# EAGLE design bga_test (EAGLE 6.4)
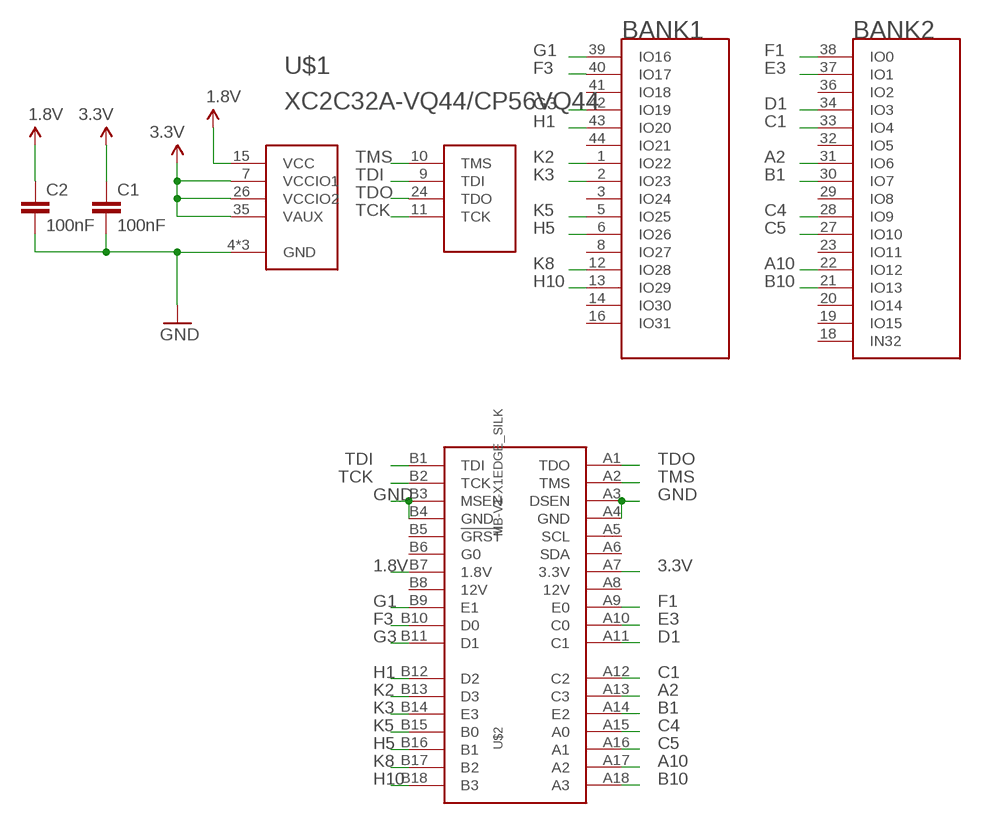
[diagram p0: schematic, sheet 1]

## Parts
C1  100nF  CAP0402-CAP  [0402-CAP]
C2  100nF  CAP0402-CAP  [0402-CAP]
U$1  XC2C32A-VQ44/CP56VQ44  [XILINX_VQ44]
U$2  MB-V1-X1EDGE_SILK  [MB-V1-X1-EDGE]

## Nets
1.8V: C2.1 U$1.15(VCC) U$2.B7(1.8V)
3.3V: C1.1 U$1.7(VCCIO1) U$1.26(VCCIO2) U$1.35(VAUX) U$2.A7(3.3V)
A2: U$1.31(IO6) U$2.A13(C3)
A10: U$1.22(IO12) U$2.A17(A2)
B1: U$1.30(IO7) U$2.A14(E2)
B10: U$1.21(IO13) U$2.A18(A3)
C1: U$1.33(IO4) U$2.A12(C2)
C4: U$1.28(IO9) U$2.A15(A0)
C5: U$1.27(IO10) U$2.A16(A1)
D1: U$1.34(IO3) U$2.A11(C1)
E3: U$1.37(IO1) U$2.A10(C0)
F1: U$1.38(IO0) U$2.A9(E0)
F3: U$1.40(IO17) U$2.B10(D0)
G1: U$1.39(IO16) U$2.B9(E1)
G3: U$1.42(IO19) U$2.B11(D1)
GND: C1.2 C2.2 U$1.4(GND) U$1.17(GND) U$1.25(GND) U$2.A3(DSEN) U$2.A4(GND) U$2.B3(MSEN) U$2.B4(GND)
H1: U$1.43(IO20) U$2.B12(D2)
H5: U$1.6(IO26) U$2.B16(B1)
H10: U$1.13(IO29) U$2.B18(B3)
K2: U$1.1(IO22) U$2.B13(D3)
K3: U$1.2(IO23) U$2.B14(E3)
K5: U$1.5(IO25) U$2.B15(B0)
K8: U$1.12(IO28) U$2.B17(B2)
TCK: U$1.11(TCK) U$2.B2(TCK)
TDI: U$1.9(TDI) U$2.B1(TDI)
TDO: U$1.24(TDO) U$2.A1(TDO)
TMS: U$1.10(TMS) U$2.A2(TMS)
Unconnected: U$1.3(IO24) U$1.8(IO27) U$1.14(IO30) U$1.16(IO31) U$1.18(IN32) U$1.19(IO15) U$1.20(IO14) U$1.23(IO11) U$1.29(IO8) U$1.32(IO5) U$1.36(IO2) U$1.41(IO18) U$1.44(IO21) U$2.A5(SCL) U$2.A6(SDA) U$2.A8(12V) U$2.B5(!GRST) U$2.B6(G0) U$2.B8(12V)

## Library data of the parts
C1 C2 = SparkFun-Capacitors:CAP: Capacitor Standard 0603 ceramic capacitor, and 0.1" leaded capacitor.
U$1 = kmod-xilinx:XC2C32A-VQ44/CP56: XC2C32A, with support for the VQ44 and CP56 footprints
U$2 = kmod-connectors:MB-V1-X1

## Board
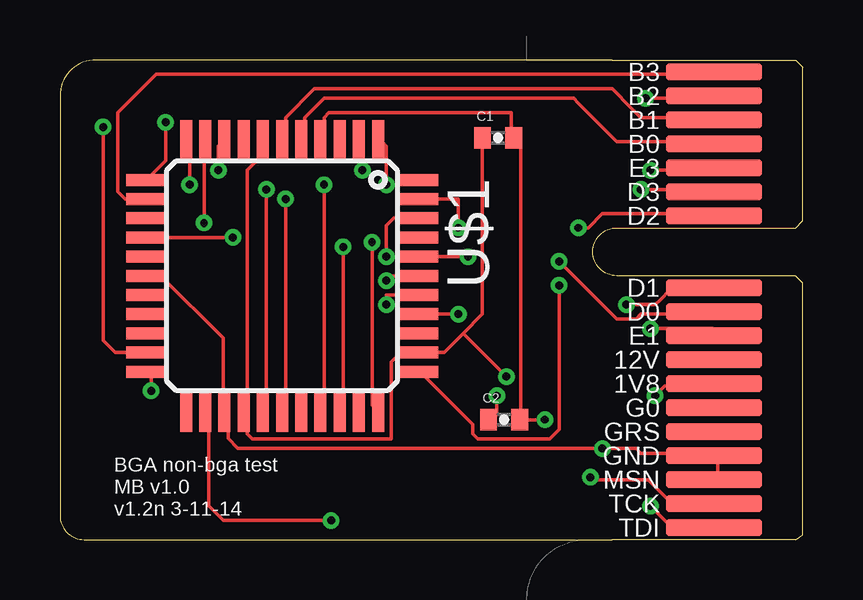
[diagram p1: board, top side]
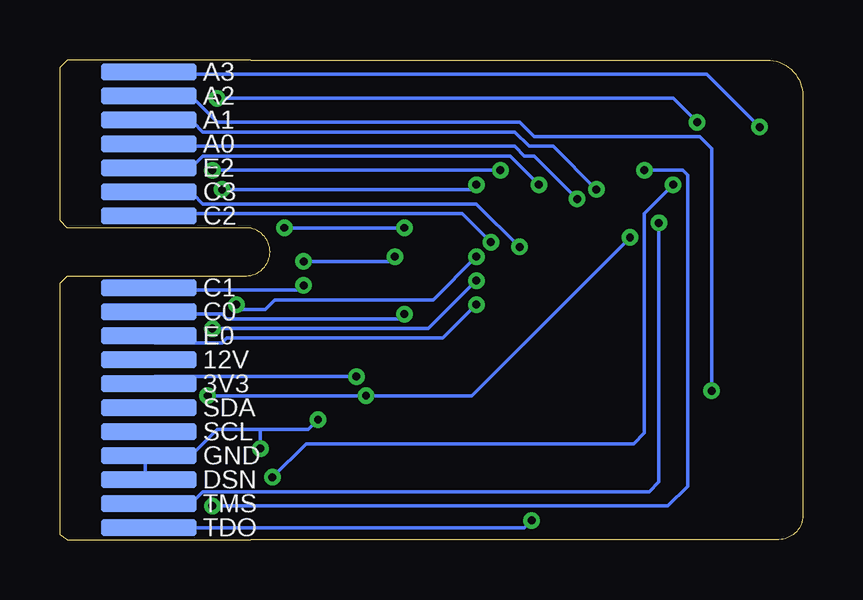
[diagram p2: board, bottom side, seen from below]

Size 30.95 x 20 mm. Coordinates in mm from the lower left corner, seen from the top.
Outline: 23,20 1.5,20 arc90 0,18.5 0,1 arc90 1,0 23,0
Copper layers (1*16): Top 0.0356mm / dielectric 1.5011mm / Bottom 0.0356mm
Design rules "OSHPark_mine *": minimum track width 6mil, minimum drill 13mil, track to track 6mil, track to pad 6mil, pad to pad 6mil, via to via 6mil, smd to smd 6mil, copper to edge 15mil, drill to drill 6mil, minimum pad ring 7mil, minimum via ring 7mil, stop-mask expansion 2mil, vias tented up to drill 13mil, thermal gap 10mil

### Footprints (pad centres in the part's own frame; a part is rotated, then mirrored left to right if it is on the bottom)
0402-CAP = smd 0.7 x 0.9: 1 -0.65,0; 2 0.65,0
XILINX_VQ44 = smd 1.6 x 0.5: 1 -5.7,4; 2 -5.7,3.2; 3 -5.7,2.4; 4 -5.7,1.6; 5 -5.7,0.8; 6 -5.7,0; 7 -5.7,-0.8; 8 -5.7,-1.6; 9 -5.7,-2.4; 10 -5.7,-3.2; 11 -5.7,-4; 23 5.7,-4; 24 5.7,-3.2; 25 5.7,-2.4; 26 5.7,-1.6; 27 5.7,-0.8; 28 5.7,0; 29 5.7,0.8; 30 5.7,1.6; 31 5.7,2.4; 32 5.7,3.2; 33 5.7,4 | smd 0.5 x 1.6: 12 -4,-5.7; 13 -3.2,-5.7; 14 -2.4,-5.7; 15 -1.6,-5.7; 16 -0.8,-5.7; 17 0,-5.7; 18 0.8,-5.7; 19 1.6,-5.7; 20 2.4,-5.7; 21 3.2,-5.7; 22 4,-5.7; 34 4,5.7; 35 3.2,5.7; 36 2.4,5.7; 37 1.6,5.7; 38 0.8,5.7; 39 0,5.7; 40 -0.8,5.7; 41 -1.6,5.7; 42 -2.4,5.7; 43 -3.2,5.7; 44 -4,5.7
MB-V1-X1-EDGE = smd 0.7 x 4 bottom: A1 -11.5,-0.75; A2 -10.5,-0.75; A3 -9.5,-0.75; A4 -8.5,-0.75; A5 -7.5,-0.75; A6 -6.5,-0.75; A7 -5.5,-0.75; A8 -4.5,-0.75; A9 -3.5,-0.75; A10 -2.5,-0.75; A11 -1.5,-0.75; A12 1.5,-0.75; A13 2.5,-0.75; A14 3.5,-0.75; A15 4.5,-0.75; A16 5.5,-0.75; A17 6.5,-0.75; A18 7.5,-0.75 | smd 0.7 x 4: B1 -11.5,-0.75; B2 -10.5,-0.75; B3 -9.5,-0.75; B4 -8.5,-0.75; B5 -7.5,-0.75; B6 -6.5,-0.75; B7 -5.5,-0.75; B8 -4.5,-0.75; B9 -3.5,-0.75; B10 -2.5,-0.75; B11 -1.5,-0.75; B12 1.5,-0.75; B13 2.5,-0.75; B14 3.5,-0.75; B15 4.5,-0.75; B16 5.5,-0.75; B17 6.5,-0.75; B18 7.5,-0.75

### Placement (x,y rotation side)
C1  18.25,16.75 0 top
C2  18.5,5 0 top
U$1  9.25,11 270 top
U$2  26.5,12 90 top

### Tracks (layer width: path | path; a pad name or v marks a point on that pad's centre or on a via)
1.8V  (via drill 0.33)
  Top 0.152: v18.2,6 18.2,5.2 18,5 C2.1 | v24.8,6 25.2,6.4 27.2,6.4 U$2.B7 | v7.2,12.6 U$1.15
  Bottom 0.152: v24.8,6 v18.2,6 13.8,6 v7.2,12.6
3.3V  (via drill 0.33)
  Top 0.152: U$1.7 8.4,16.6 8.4,16 7.8,15.4 7.8,5.4 U$1.26 7.8,5.2 7.8,4.4 8,4.2 13.8,4.2 13.8,7.4 14.2,7.8 U$1.35 16,7.8 16.8,8.6 | C1.1 17.6,9.4 16.8,8.6 | 16.8,8.6 v18.6,6.8
  Bottom 0.152: v18.6,6.8 27,6.8 27.2,6.6 U$2.A7
A2  (via drill 0.33)
  Top 0.152: v11.8,12.2 11.8,5.4 U$1.31
  Bottom 0.152: v11.8,12.2 13.6,14 25,14 25.4,14.4 27.2,14.4 U$2.A13
A10  (via drill 0.33)
  Top 0.152: v3.8,6.2 3.8,6.8 3.6,7 U$1.22
  Bottom 0.152: v3.8,6.2 3.8,16.3 4.3,16.8 11.2,16.8 11.8,17.4 24.4,17.4 25.4,18.4 27.2,18.4 U$2.A17
B1  (via drill 0.33)
  Top 0.152: v11,14.8 11,5.4 U$1.30
  Bottom 0.152: v11,14.8 12.2,16 25,16 25.4,15.6 27.2,15.6 U$2.A14
B10  (via drill 0.33)
  Top 0.152: v1.8,17.2 1.8,8.31 2.31,7.8 U$1.21
  Bottom 0.152: v1.8,17.2 4,19.4 27.2,19.4 U$2.A18
C1  (via drill 0.33)
  Top 0.152: v13,12.4 13,5.6 13.2,5.4 U$1.33
  Bottom 0.152: v13,12.4 14.2,13.6 27.2,13.6 U$2.A12
C4  (via drill 0.33)
  Top 0.152: v9.4,14.2 9.4,5.4 U$1.28
  Bottom 0.152: v9.4,14.2 11.2,16 11.6,16 12,16.4 27.2,16.4 U$2.A15
C5  (via drill 0.33)
  Top 0.152: v8.6,14.6 8.6,5.4 U$1.27
  Bottom 0.152: v8.6,14.6 10.4,16.4 11.4,16.4 12,17 25,17 25.4,17.4 27.2,17.4 U$2.A16
D1  (via drill 0.33)
  Top 0.152: v20.8,10.6 20.8,4.6 20.4,4.2 17.4,4.2 17.2,4.4 17.2,4.8 15,7 U$1.34
  Bottom 0.152: v20.8,10.6 21,10.4 27.2,10.4 U$2.A11
E3  (via drill 0.33)
  Top 0.152: v16.6,9.4 U$1.37
  Bottom 0.152: v16.6,9.4 16.8,9.2 24,9.2 24.2,9.4 27.2,9.4 U$2.A10
F1  (via drill 0.33)
  Top 0.152: U$1.38 13.6,10.2 v13.6,9.8
  Bottom 0.152: v13.6,9.8 15,8.4 24,8.4 24.2,8.2 27,8.2 27.2,8.4 U$2.A9
F3  (via drill 0.33)
  Top 0.152: v17,11.8 U$1.40 | v20.8,11.6 23.2,9.2 24,9.2 24.2,9.4 27.2,9.4 U$2.B10
  Bottom 0.152: v17,11.8 17.2,11.6 v20.8,11.6
G1  (via drill 0.33)
  Top 0.152: U$1.39 13.6,11 v13.6,10.8 | v24.6,8.8 27.2,8.8 27.2,8.6 U$2.B9
  Bottom 0.152: v13.6,10.8 15.6,8.8 v24.6,8.8
G3  (via drill 0.33)
  Top 0.152: v13.6,11.8 13.6,13.1 13.9,13.4 U$1.42 | v23.6,9.8 24.8,9.8 25,10 25.4,10.4 27.2,10.4 U$2.B11
  Bottom 0.152: v13.6,11.8 15.4,10 22,10 22.4,9.6 23.4,9.6 v23.6,9.8
GND  (via drill 0.33)
  Top 0.152: 19.2,5 19.2,16.4 19,16.6 C1.2 18.8,16.8 18.8,17.8 11.2,17.8 11,17.6 11,16.8 U$1.4 | U$2.A3 27.4,2.6 27.4,3.4 U$2.A4 27.2,3.6 24.2,3.6 24,3.8 v22.6,3.8 7.41,3.8 7,4.21 7,5.2 U$1.25 6.8,5.4 6.8,8.4 4.2,11 U$1.17 | v20.2,5 19.2,5 | 19.2,5 C2.2
  Bottom 0.152: U$2.A3 27.4,2.6 27.4,3.4 U$2.A4 27.2,3.6 25.4,3.6 24.4,4.6 22.6,4.6 | v20.2,5 20.6,4.6 22.6,4.6 | v22.6,3.8 22.6,4.6
H1  (via drill 0.33)
  Top 0.152: U$1.43 16.6,14.2 v16.6,13 | v21.6,13 22,13 22.6,13.6 27.2,13.6 U$2.B12
  Bottom 0.152: v21.6,13 v16.6,13
H5
  Top 0.152: U$1.6 9.4,16.8 9.4,17.6 10.6,18.8 23,18.8 23.8,18 24.2,17.6 27.2,17.6 U$2.B16
H10
  Top 0.152: U$1.13 2.72,14.2 2.4,14.52 2.4,17.8 4,19.4 27.2,19.4 U$2.B18
K2  (via drill 0.33)
  Top 0.152: v13.6,14.8 13.6,16.4 13.4,16.6 U$1.1 | v24.2,14.6 27.2,14.6 U$2.B13
  Bottom 0.152: v13.6,14.8 13.8,14.6 v24.2,14.6
K3  (via drill 0.33)
  Top 0.152: v12.6,15.4 12.6,16.6 U$1.2 | v24.6,15.4 27.2,15.4 U$2.B14
  Bottom 0.152: v24.6,15.4 v12.6,15.4
K5
  Top 0.152: U$1.5 10.2,16.8 10.2,17.6 11,18.4 21.4,18.4 21.6,18.2 23.2,16.6 27.2,16.6 U$2.B15
K8  (via drill 0.33)
  Top 0.152: v4.4,17.4 4.4,15.8 3.6,15 U$1.12 | v24.4,18.4 27.2,18.4 U$2.B17
  Bottom 0.152: v4.4,17.4 5.4,18.4 v24.4,18.4
TCK  (via drill 0.33)
  Top 0.152: v5.4,14.8 5.4,16.6 U$1.11 | U$2.B2 27.2,1.6 25.4,1.6 24.5,2.5 22.2,2.5 v22.1,2.6
  Bottom 0.152: v5.4,14.8 6.6,13.6 6.6,4.45 7.05,4 20.7,4 v22.1,2.6
TDI  (via drill 0.33)
  Top 0.152: v6.6,15.4 6.6,16.4 6.8,16.6 U$1.9 | v24.6,1.4 25.4,0.6 27.2,0.6 U$2.B1
  Bottom 0.152: v6.6,15.4 5,15.4 4.8,15.2 4.8,2.23 5.62,1.4 v24.6,1.4
TDO  (via drill 0.33)
  Top 0.152: U$1.24 6.2,5.2 6.2,1.4 6.8,0.8 v11.3,0.8
  Bottom 0.152: 27.2,0.6 U$2.A1 11.6,0.5 v11.3,0.8
TMS  (via drill 0.33)
  Top 0.152: v6,13.2 6,16.6 U$1.10
  Bottom 0.152: v6,13.2 6,2.4 6.4,2 25,2 25.4,1.6 27.2,1.6 U$2.A2

### Text on the board
tPlace: BGA non-bga test / MB v1.0 / v1.2n 3-11-14